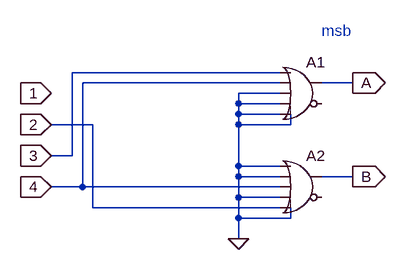
[diagram p0: schematic 4dec2bits.asc]
4dec2bits.asc, the LTspice schematic file:
Version 4
SHEET 1 880 680
WIRE 240 16 -80 16
WIRE 240 32 -64 32
WIRE 352 32 304 32
WIRE 240 48 176 48
WIRE 176 64 176 48
WIRE 240 64 176 64
WIRE 176 80 176 64
WIRE 240 80 176 80
WIRE -48 96 -112 96
WIRE 176 96 176 80
WIRE 256 96 256 80
WIRE 256 96 176 96
WIRE -80 144 -80 16
WIRE -80 144 -112 144
WIRE 176 160 176 96
WIRE 240 160 176 160
WIRE 176 176 176 160
WIRE 240 176 176 176
WIRE 352 176 304 176
WIRE -64 192 -64 32
WIRE -64 192 -112 192
WIRE 240 192 -64 192
WIRE 176 208 176 176
WIRE 240 208 176 208
WIRE -48 224 -48 96
WIRE 240 224 -48 224
WIRE 176 240 176 208
WIRE 256 240 256 224
WIRE 256 240 176 240
WIRE 176 272 176 240
FLAG 352 32 A
IOPIN 352 32 Out
FLAG 352 176 B
IOPIN 352 176 Out
FLAG -112 48 1
IOPIN -112 48 In
FLAG -112 96 2
IOPIN -112 96 In
FLAG -112 144 3
IOPIN -112 144 In
FLAG -112 192 4
IOPIN -112 192 In
FLAG 176 272 0
SYMBOL Digital\\or 272 -16 R0
SYMATTR InstName A1
SYMBOL Digital\\or 272 128 R0
SYMATTR InstName A2
TEXT 304 -48 Left 2 ;msb

The netlist it stands for:
* 4dec2bits.asc
A1 3 4 0 0 0 0 A 0 OR
A2 0 0 4 0 2 0 B 0 OR
* msb
.backanno
.end